# Altium project Isense_amp.PrjPcb
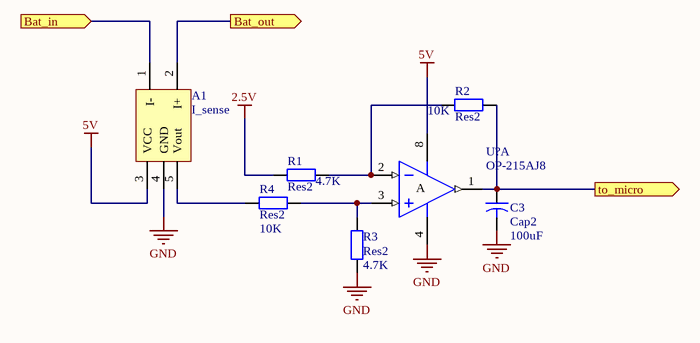
[diagram p0: diff_amp.SchDoc]
1 sheet, 7 parts. Net scope: flat (ports and power ports of the same name join across sheets).

## Sheet diff_amp.SchDoc
size A4

### Parts
A1  I_sense
C3  Cap2  value 100uF  [CAPR5-4X5]
R1  Res2  value 4.7K  [AXIAL-0.4]
R2  Res2  value 10K  [AXIAL-0.4]
R3  Res2  value 4.7K  [AXIAL-0.4]
R4  Res2  value 10K  [AXIAL-0.4]
U?  OP-215AJ8  [J8]  (part A of 2)

### Ports
Bat_in (in), Bat_out (out), to_micro (out)

### Nets
2.5V: R1.1
5V: A1.3(VCC) U?.8(V+)
GND: A1.4(GND) C3.2 R3.1 U?.4(V-)
NetA1_1: A1.1(I-) ; port Bat_in
NetA1_2: A1.2(I+) ; port Bat_out
NetA1_5: A1.5(Vout) R4.1
NetC3_1: C3.1 R2.2 U?.1(OUT) ; port to_micro
NetR1_2: R1.2 R2.1 U?.2(IN-)
NetR3_2: R3.2 R4.2 U?.3(IN+)

### Notes on the sheet
- (in symbol OP-215AJ8, part A) A

### Library data of the parts
A1 = ACS758: Current Sensor
C3 = Cap2: Capacitor; Published: 23-Sep-2002; PackageReference: CAPR5-4X5; Publisher: Altium Limited; PackageDescription: Capacitor; 2 Leads
R1-R4 = Res2: Resistor; Published: 8-Jun-2000; LatestRevisionDate: 17-Jul-2002; LatestRevisionNote: Re-released for DXP Platform.; PackageReference: AXIAL-0.4; Publisher: Altium Limited; PackageDescription: Axial Device, Thru-Hole; 2 Leads; 0.4 in Pin Spacing
U? = OP-215AJ8: Dual Precision JFET-Input Operational Amplifier; Note: 1882; Published: 8-Jun-2000; LatestRevisionDate: 29-May-2009; LatestRevisionNote: Component Body Added.; DatasheetVersion: 1990; PackageVersion: J8 0801; PackageReference: J8; Publisher: Altium Limited; PackageDescription: DIP, Ceramic, 8-Pin, Row Spacing 7.62 mm, Pitch 2.54 mm; ComponentLink1Description: Manufacturer Link; ComponentLink1URL: http://www.linear.com/; ComponentLink2Description: Datasheet; ComponentLink2URL: http://www.linear.com/pc/downloadDocument.do?navId=H0,C3,P1202,D3780